# Altium project PetBallLauncher.PrjPcb
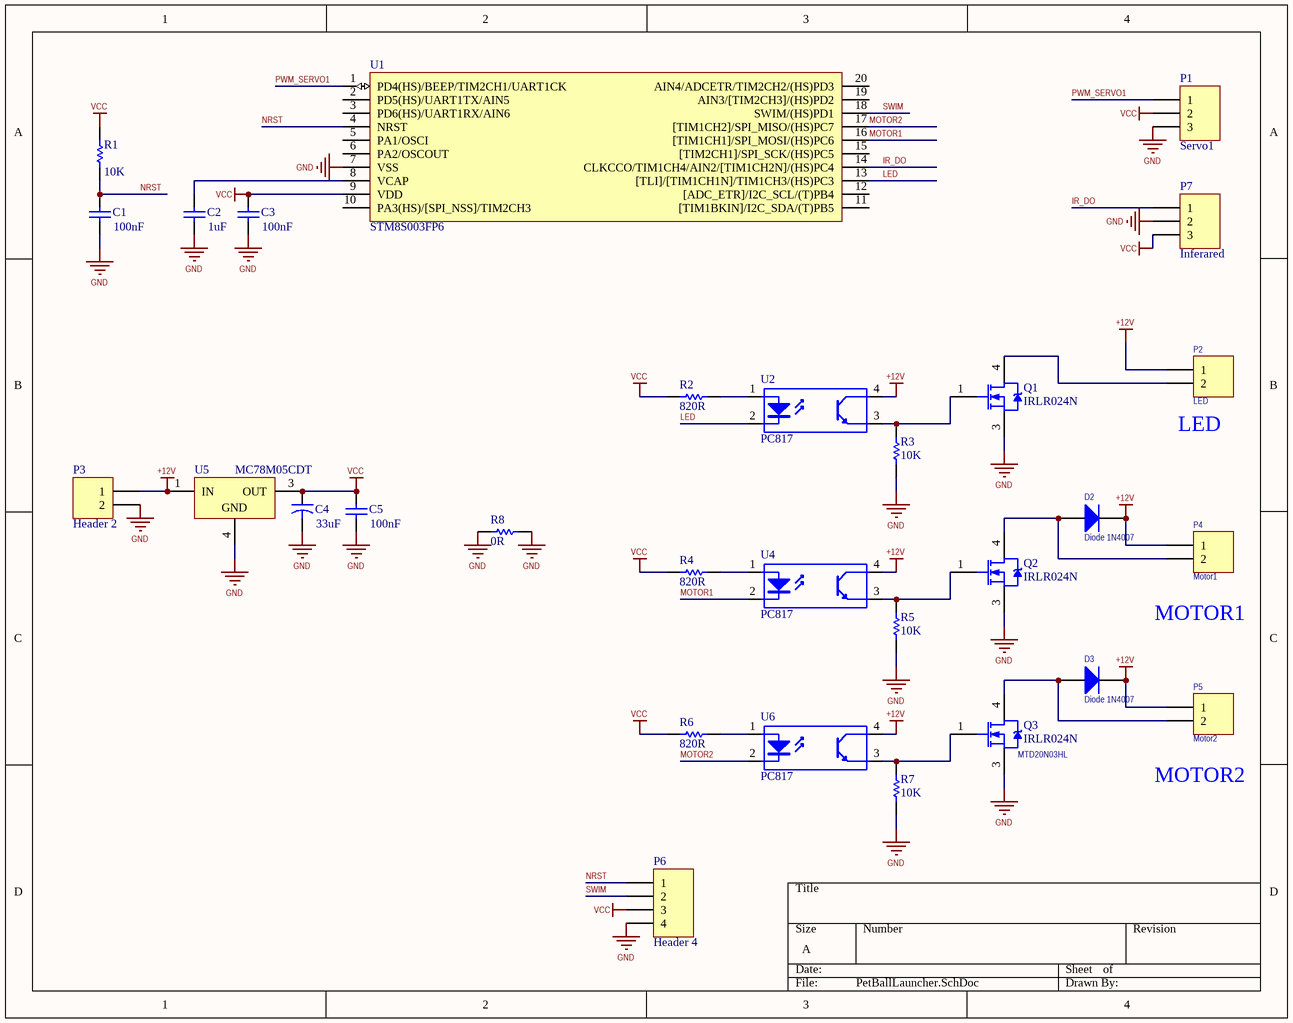
[diagram p0: PetBallLauncher.SchDoc]
1 sheet, 30 parts. Net scope: global (net labels, ports and power ports of the same name join across sheets).
Board file: PetBallLauncher.PcbDoc

## Sheet PetBallLauncher.SchDoc
size A

### Parts
C1  value 100nF  [CAP_MLCC_RAD_0.1]  (hidden comment: Cap)
C2  value 1uF  [CAP_MLCC_RAD_0.1]  (hidden comment: Cap)
C3  value 100nF  [CAP_MLCC_RAD_0.1]  (hidden comment: Cap)
C4  value 33uF  [Cap electrolitic radial 6x7-2.5]  (hidden comment: Cap2)
C5  value 100nF  [CAP_MLCC_RAD_0.1]  (hidden comment: Cap)
D2  Diode 1N4007  [DO-241AC]
D3  Diode 1N4007  [DO-241AC]
P1  Servo1  [HDR_1x3]
P2  LED  [KF301 2PIN]
P3  Header 2  [KF301 2PIN]
P4  Motor1  [KF301 2PIN]
P5  Motor2  [KF301 2PIN]
P6  Header 4  [HDR1X4]
P7  Inferared  [HDR_1x3]
Q1  IRLR024N  [TO252-3M]
Q2  IRLR024N  [TO252-3M]
Q3  IRLR024N  [TO252-3M]
R1  value 10K  [Axial 0_25 W, 0_4 IN LEAD PITCH]  (hidden comment: Res1)
R2  820R  [RES0805]
R3  10K  [RES0805]
R4  820R  [RES0805]
R5  10K  [RES0805]
R6  820R  [RES0805]
R7  10K  [RES0805]
R8  0R  [axial-0.3]
U1  STM8S003FP6  [TSSOP20]
U2  PC817  [DIP_4]
U4  PC817  [DIP_4]
U5  MC78M05CDT  [TO252-3M]
U6  PC817  [DIP_4]

### Nets
+12V: D2.2(K) D3.2(K) P2.1 P3.1 P4.1 P5.1 U2.4(C) U4.4(C) U5.1(IN) U6.4(C)
GND: C1.1 C2.1 C3.1 C4.2 C5.1 P1.3 P3.2 P6.4 P7.2 Q1.3(S) Q2.3(S) Q3.3(S) R3.1 R5.1 R7.1 R8.1 R8.2 U1.7(VSS) U5.4(GND)
VCC: C3.2 C4.1 C5.2 P1.2 P6.3 P7.3 R1.2 R2.1 R4.1 R6.1 U1.9(VDD) U5.3(OUT)
IR_DO: P7.1 U1.14(CLKCCO/TIM1CH4/AIN2/[TIM1CH2N]/(HS)PC4)
LED: U1.13([TLI]/[TIM1CH1N]/TIM1CH3/(HS)PC3) U2.2(K)
MOTOR1: U1.16([TIM1CH1]/SPI_MOSI/(HS)PC6) U4.2(K)
MOTOR2: U1.17([TIM1CH2]/SPI_MISO/(HS)PC7) U6.2(K)
NRST: C1.2 P6.1 R1.1 U1.4(NRST)
PWM_SERVO1: P1.1 U1.1(PD4(HS)/BEEP/TIM2CH1/UART1CK)
SWIM: P6.2 U1.18(SWIM/(HS)PD1)
NetC2_2: C2.2 U1.8(VCAP)
NetD2_1: D2.1(A) P4.2 Q2.4(D)
NetD3_1: D3.1(A) P5.2 Q3.4(D)
NetP2_2: P2.2 Q1.4(D)
NetQ1_1: Q1.1(G) R3.2 U2.3(E)
NetQ2_1: Q2.1(G) R5.2 U4.3(E)
NetQ3_1: Q3.1(G) R7.2 U6.3(E)
NetR2_2: R2.2 U2.1(A)
NetR4_2: R4.2 U4.1(A)
NetR6_2: R6.2 U6.1(A)

Not connected (* = marked no-connect by the designer): U1 2(PD5(HS)/UART1TX/AIN5) 3(PD6(HS)/UART1RX/AIN6) 5(PA1/OSCI) 6(PA2/OSCOUT) 10(PA3(HS)/[SPI_NSS]/TIM2CH3) 11([TIM1BKIN]/I2C_SDA/(T)PB5) 12([ADC_ETR]/I2C_SCL/(T)PB4) 15([TIM2CH1]/SPI_SCK/(HS)PC5) 19(AIN3/[TIM2CH3]/(HS)PD2) 20(AIN4/ADCETR/TIM2CH2/(HS)PD3)

### Notes on the sheet
- (near P2) LED
- (near P4) MOTOR1
- (near Q3) MTD20N03HL
- (near P5) MOTOR2

### Library data of the parts
C1-C3 C5 = Cap: Capacitor; Published: 8-Jun-2000; LatestRevisionDate: 17-Jul-2002; LatestRevisionNote: Re-released for DXP Platform.; PackageReference: RAD-0.3; Publisher: Altium Limited; PackageDescription: Radial Cap, Thru-Hole; 2 Leads; 0.3 in Pin Spacing
C4 = Cap2: Capacitor; Published: 23-Sep-2002; PackageReference: CAPR5-4X5; Publisher: Altium Limited; PackageDescription: Capacitor; 2 Leads
D2 D3 = Diode 1N4007: 1 Amp General Purpose Rectifier; Published: 8-Jun-2000; LatestRevisionDate: 17-Jul-2002; LatestRevisionNote: Re-released for DXP Platform.; DatasheetVersion: 1998; PackageVersion: Aug-1999; PackageReference: DO-41; Publisher: Altium Limited; PackageDescription: Diode, Axial; Body 5.2 x 2.7 mm (LxDia. max), Lead Dia. 0.86 mm (max); Code_JEDEC: DO-204-AL; ComponentLink1Description: Manufacturer Link; ComponentLink1URL: http://www.fairchildsemi.com/; ComponentLink2Description: Datasheet; ComponentLink2URL: http://www.fairchildsemi.com/ds/1N%2F1N4001.pdf
P1 P7 = Header 3: Header, 3-Pin; LatestRevisionDate: 17-Jul-2002; LatestRevisionNote: Re-released for DXP Platform.; Publisher: Altium Limited
P2-P5 = Header 2: Header, 2-Pin; LatestRevisionDate: 17-Jul-2002; LatestRevisionNote: Re-released for DXP Platform.; Publisher: Altium Limited
P6 = Header 4: Header, 4-Pin; LatestRevisionDate: 17-Jul-2002; LatestRevisionNote: Re-released for DXP Platform.; Publisher: Altium Limited
Q1-Q3 = IRLR024N: HEXFET Power MOSFET; Note: Pin 2 is trimmed and is electrically connected to Drain.; Published: 8-Jun-2000; LatestRevisionDate: 20-Nov-2009; LatestRevisionNote: IPC-7351 Footprint Added.; PackageVersion: Feb-2003; PackageReference: TO-252AA; Publisher: Altium Limited; PackageDescription: 3-Pin HEXFET Package 2.28 mm Pitch, 9.9 mm Lead Span; Code_JEDEC: TO-252-AA; ComponentLink1Description: Manufacturer Link; ComponentLink1URL: http://www.irf.com/; ComponentLink2Description: Datasheet; ComponentLink2URL: http://www.irf.com/product-info/datasheets/data/irlr024n.pdf
R1-R7 = Res1: Resistor; Published: 8-Jun-2000; LatestRevisionDate: 17-Jul-2002; LatestRevisionNote: Re-released for DXP Platform.; PackageReference: AXIAL-0.3; Publisher: Altium Limited; PackageDescription: Axial Device, Thru-Hole; 2 Leads; 0.3 in Pin Spacing
  R2 R4 R6: Value: 820R
  R3 R5 R7: Value: 10K
R8 = Res1: Resistor; Value: 820R; Published: 8-Jun-2000; LatestRevisionDate: 17-Jul-2002; LatestRevisionNote: Re-released for DXP Platform.; PackageReference: AXIAL-0.3; Publisher: Altium Limited; PackageDescription: Axial Device, Thru-Hole; 2 Leads; 0.3 in Pin Spacing
U1 = STM8S003F3Px: 8 bit microcontroller
U2 U4 U6 = Optoisolator1: 4-Pin Phototransistor Optocoupler; Published: 24-Mar-1999; LatestRevisionDate: 04-Mar-2005; LatestRevisionNote: Sch pins 3 & 4 Swapped.; DatasheetVersion: Nov-2003; PackageReference: DIP-4; Publisher: Altium Limited
U5 = MC78M05CDT: 3-Terminal Medium-Current Positive Fixed Voltage Regulator; Note: Heatsink suface connected to pin 4.; Published: 17-Jul-2002; DatasheetVersion: 1988; PackageReference: 369A-03; Publisher: Altium Limited; PackageDescription: D-PAK/TO-252-AA; 3 Leads (1 Cropped); Body 10.2 (inc. leads) x 6.7 mm (LxW max); ComponentLink1Description: Manufacturer Link; ComponentLink1URL: http://www.onsemi.com/site/products/taxonomy/0,4438,503,00.html; ComponentLink2Description: Datasheet; ComponentLink2URL: http://www.onsemi.com/pub/Collateral/MC78M00-D.PDF